# EAGLE schematic Alarm (EAGLE 8.4.1)
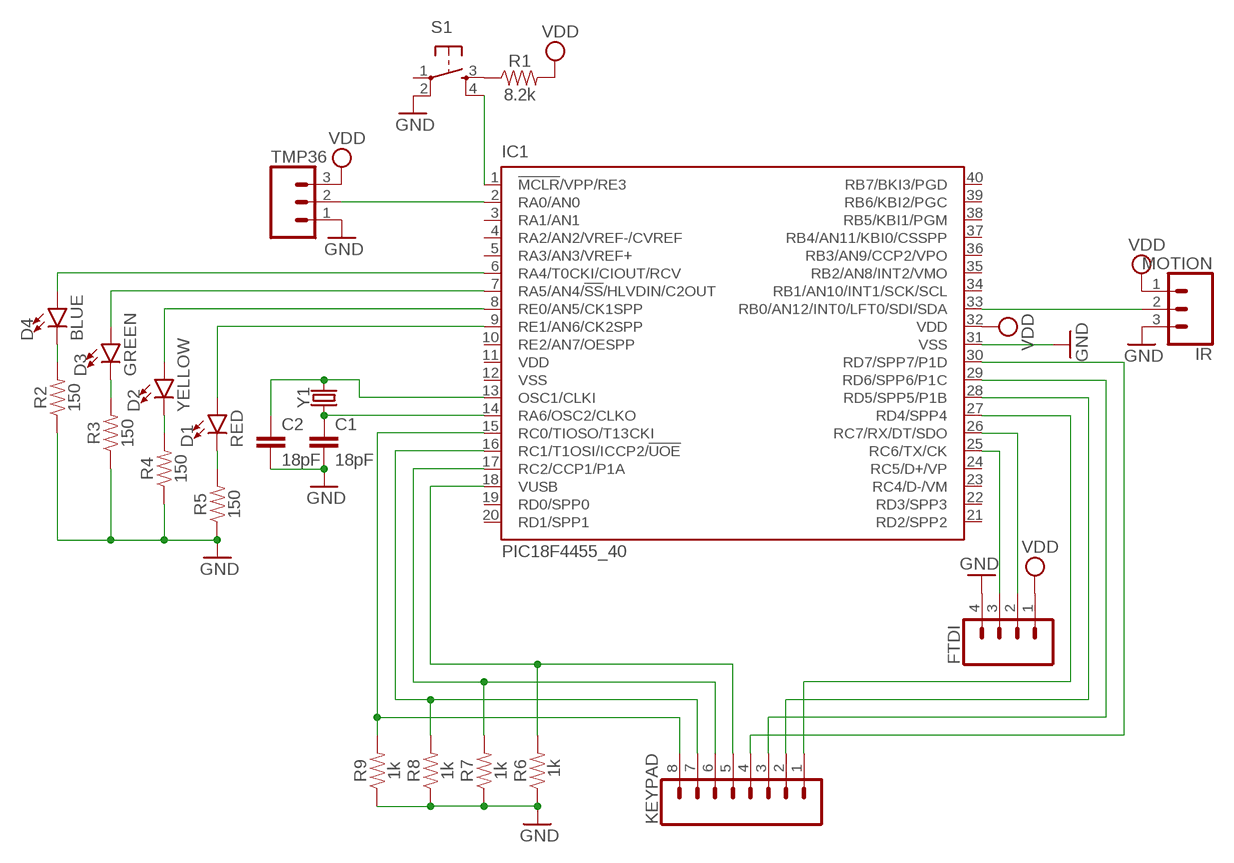
[diagram p0: schematic, sheet 1]

## Parts
C1  18pF  0.1UF-0402-16V-10%  [0402]
C2  18pF  0.1UF-0402-16V-10%  [0402]
D1  RED  LED-BLUE0603  [LED-0603]
D2  YELLOW  LED-BLUE0603  [LED-0603]
D3  GREEN  LED-BLUE0603  [LED-0603]
D4  BLUE  LED-BLUE0603  [LED-0603]
FTDI  CONN_04  [1X04]
IC1  PIC18F4455_40  [DIL40]
IR  MOTION  CONN_03  [1X03]
KEYPAD  CONN_08"  [1X08]
R1  8.2k  0.1OHM-1210-1/2W-1%  [1210]
R2  150  0.1OHM-1210-1/2W-1%  [1210]
R3  150  0.1OHM-1210-1/2W-1%  [1210]
R4  150  0.1OHM-1210-1/2W-1%  [1210]
R5  150  0.1OHM-1210-1/2W-1%  [1210]
R6  1k  0.1OHM-1210-1/2W-1%  [1210]
R7  1k  0.1OHM-1210-1/2W-1%  [1210]
R8  1k  0.1OHM-1210-1/2W-1%  [1210]
R9  1k  0.1OHM-1210-1/2W-1%  [1210]
S1  TAC_SWITCHPTH  [TACTILE-PTH]
TMP36  CONN_03  [1X03]
Y1  CRYSTALPTH-HC49US  [HC49US]

## Nets
GND: C1.2 C2.2 FTDI.4 IC1.31(VSS) IR.3 R2.1 R3.1 R4.1 R5.1 R6.1 R7.1 R8.1 R9.1 S1.2 TMP36.1
N$1: C1.1 IC1.14(RA6/OSC2/CLKO) Y1.1
N$2: C2.1 IC1.13(OSC1/CLKI) Y1.2
N$3: IC1.33(RB0/AN12/INT0/LFT0/SDI/SDA) IR.2
N$4: FTDI.2 IC1.26(RC7/RX/DT/SDO)
N$5: FTDI.3 IC1.25(RC6/TX/CK)
N$6: IC1.2(RA0/AN0) TMP36.2
N$7: IC1.1(!MCLR!/VPP/RE3) S1.4
N$8: R1.1 S1.3
N$9: D4.A IC1.6(RA4/T0CKI/CIOUT/RCV)
N$10: D3.A IC1.7(RA5/AN4/!SS!/HLVDIN/C2OUT)
N$11: D2.A IC1.8(RE0/AN5/CK1SPP)
N$12: D1.A IC1.9(RE1/AN6/CK2SPP)
N$13: D4.C R2.2
N$14: D3.C R3.2
N$15: D2.C R4.2
N$16: D1.C R5.2
N$17: IC1.27(RD4/SPP4) KEYPAD.1
N$18: IC1.28(RD5/SPP5/P1B) KEYPAD.2
N$19: IC1.29(RD6/SPP6/P1C) KEYPAD.3
N$20: IC1.30(RD7/SPP7/P1D) KEYPAD.4
N$21: IC1.15(RC0/TIOSO/T13CKI) KEYPAD.8 R9.2
N$23: IC1.17(RC2/CCP1/P1A) KEYPAD.6 R7.2
N$26: IC1.16(RC1/T1OSI/ICCP2/!UOE) KEYPAD.7 R8.2
N$27: IC1.18(VUSB) KEYPAD.5 R6.2
VDD: FTDI.1 IC1.32(VDD) IR.1 R1.2 TMP36.3
Unconnected: IC1.3(RA1/AN1) IC1.4(RA2/AN2/VREF-/CVREF) IC1.5(RA3/AN3/VREF+) IC1.10(RE2/AN7/OESPP) IC1.19(RD0/SPP0) IC1.20(RD1/SPP1) IC1.21(RD2/SPP2) IC1.22(RD3/SPP3) IC1.23(RC4/D-/VM) IC1.24(RC5/D+/VP) IC1.34(RB1/AN10/INT1/SCK/SCL) IC1.35(RB2/AN8/INT2/VMO) IC1.36(RB3/AN9/CCP2/VPO) IC1.37(RB4/AN11/KBI0/CSSPP) IC1.38(RB5/KBI1/PGM) IC1.39(RB6/KBI2/PGC) IC1.40(RB7/BKI3/PGD) S1.1

## Power pins joined to a net without a drawn wire
VDD: IC1.11(VDD)
VSS: IC1.12(VSS)

## Library data of the parts
C1 C2 = SparkFun-Capacitors:0.1UF: 0.1µF ceramic capacitors A capacitor is a passive two-terminal electrical component used to store electrical energy temporarily in an electric field.; PROD_ID: CAP-12416; VALUE: 0.1uF
D1-D3 = SparkFun-LED:LED-BLUE: Blue SMD LED Used in manufacturing of various products at SparkFun Packages: 0603 - SMD 0603 package [Product Link] <http://www.digikey.com/product-detail/en/SMLE12BC7TT86/511-1589-2-ND/1641808> 1206 - SMD1206 package [Product Link] <http://www.digikey.com/product-detail/en/lite-on-inc/LTST-C150TBKT/160-1643-1-ND/573584> SparkFun Products: ESP8266 Thing-Dev Board <https://www.sparkfun.com/products/13711> RedBoard <https://www.sparkfun.com/products/12757>; PROD_ID: DIO-08575; VALUE: BLUE
D4 = SparkFun-LED:LED-BLUE: Blue SMD LED Used in manufacturing of various products at SparkFun Packages: 0603 - SMD 0603 package [Product Link] <http://www.digikey.com/product-detail/en/SMLE12BC7TT86/511-1589-2-ND/1641808> 1206 - SMD1206 package [Product Link] <http://www.digikey.com/product-detail/en/lite-on-inc/LTST-C150TBKT/160-1643-1-ND/573584> SparkFun Products: ESP8266 Thing-Dev Board <https://www.sparkfun.com/products/13711> RedBoard <https://www.sparkfun.com/products/12757>; PROD_ID: DIO-08575
FTDI = SparkFun-Connectors:CONN_04: Multi connection point. Often used as Generic Header-pin footprint for 0.1 inch spaced/style header connections On any of the 0.1 inch spaced packages, you can populate with these: Break Away Headers - Straight <https://www.sparkfun.com/products/116> (PRT-00116) Break Away Male Headers - Right Angle <https://www.sparkfun.com/products/553> (PRT-00553) Female Headers <https://www.sparkfun.com/products/115> (PRT-00115) Break Away Headers - Machine Pin <https://www.sparkfun.com/products/117> (PRT-00117) Break Away Female Headers - Swiss Machine Pin <https://www.sparkfun.com/products/743> (PRT-00743) For SCREWTERMINALS and SPRING TERMINALS visit here: Screw Terimnals on SparkFun.com <https://www.sparkfun.com/search/results?term=Screw+Terminals> (5mm/3.5mm/2.54mm spacing) This device is also useful as a general connection point to wire up your design to another part of your project. Our various solder wires solder well into these plated through hole pads. Hook-Up Wire - Assortment (Stranded, 22 AWG) <https://www.sparkfun.com/products/11375> (PRT-11375) Hook-Up Wire - Assortment (Solid Core, 22 AWG) <https://www.sparkfun.com/products/11367> (PRT-11367) View the entire wire category on our website here <https://www.sparkfun.com/categories/141> Special notes: Molex polarized connector foot print use with SKU : PRT-08231 with associated crimp pins and housings. 1MM SMD Version SKU: PRT-10208; PROD_ID: CONN-09696
IC1 = microchip:PIC18F4*_40: USB Microcontrollers with nanoWatt Technology High-Performance, Enhanced Flash, 28/40/44-Pin, Source: http://ww1.microchip.com/downloads/en/devicedoc/39632c.pdf; MF: MICROCHIP; MPN: PIC18F4455-I/P; OC_FARNELL: 9321314; OC_NEWARK: 05K2028
IR TMP36 = SparkFun-Connectors:CONN_03: Multi connection point. Often used as Generic Header-pin footprint for 0.1 inch spaced/style header connections On any of the 0.1 inch spaced packages, you can populate with these: Break Away Headers - Straight <https://www.sparkfun.com/products/116> (PRT-00116) Break Away Male Headers - Right Angle <https://www.sparkfun.com/products/553> (PRT-00553) Female Headers <https://www.sparkfun.com/products/115> (PRT-00115) Break Away Headers - Machine Pin <https://www.sparkfun.com/products/117> (PRT-00117) Break Away Female Headers - Swiss Machine Pin <https://www.sparkfun.com/products/743> (PRT-00743) Stackable Header - 3 Pin (Female, 0.1") <https://www.sparkfun.com/products/13875> (PRT-13875) For SCREWTERMINALS and SPRING TERMINALS visit here: Screw Terimnals on SparkFun.com <https://www.sparkfun.com/search/results?term=Screw+Terminals> (5mm/3.5mm/2.54mm spacing) This device is also useful as a general connection point to wire up your design to another part of your project. Our various solder wires solder well into these plated through hole pads. Hook-Up Wire - Assortment (Stranded, 22 AWG) <https://www.sparkfun.com/products/11375> (PRT-11375) Hook-Up Wire - Assortment (Solid Core, 22 AWG) <https://www.sparkfun.com/products/11367> (PRT-11367) View the entire wire category on our website here <https://www.sparkfun.com/categories/141> Special notes: Molex polarized connector foot print use with SKU : PRT-08232 with associated crimp pins and housings.; PROD_ID: XXX-00000; VALUE: 455-1750-1-ND
KEYPAD = SparkFun-Connectors:CONN_08: Multi connection point. Often used as Generic Header-pin footprint for 0.1 inch spaced/style header connections On any of the 0.1 inch spaced packages, you can populate with these: Break Away Headers - Straight <https://www.sparkfun.com/products/116> (PRT-00116) Break Away Male Headers - Right Angle <https://www.sparkfun.com/products/553> (PRT-00553) Female Headers <https://www.sparkfun.com/products/115> (PRT-00115) Break Away Headers - Machine Pin <https://www.sparkfun.com/products/117> (PRT-00117) Break Away Female Headers - Swiss Machine Pin <https://www.sparkfun.com/products/743> (PRT-00743) Arduino Stackable Header - 8 Pin <https://www.sparkfun.com/products/9279> (PRT-09279) For SCREWTERMINALS and SPRING TERMINALS visit here: Screw Terimnals on SparkFun.com <https://www.sparkfun.com/search/results?term=Screw+Terminals> (5mm/3.5mm/2.54mm spacing) This device is also useful as a general connection point to wire up your design to another part of your project. Our various solder wires solder well into these plated through hole pads. Hook-Up Wire - Assortment (Stranded, 22 AWG) <https://www.sparkfun.com/products/11375> (PRT-11375) Hook-Up Wire - Assortment (Solid Core, 22 AWG) <https://www.sparkfun.com/products/11367> (PRT-11367) View the entire wire category on our website here <https://www.sparkfun.com/categories/141> Special notes: Molex polarized connector foot print use with SKU : PRT-08231 with associated crimp pins and housings. 1MM SMD Version SKU: PRT-10208 NOTES ON THE VARIANTS LOCK and LOCK_LONGPADS... This footprint was designed to help hold the alignment of a through-hole component (i.e. 6-pin header) while soldering it into place. You may notice that each hole has been shifted either up or down by 0.005 of an inch from it's more standard position (which is a perfectly straight line). This slight alteration caused the pins (the squares in the middle) to touch the edges of the holes. Because they are alternating, it causes a "brace" to hold the component in place. 0.005 has proven to be the perfect amount of "off-center" position when using our standard breakaway headers. Although looks a little odd when you look at the bare footprint, once you have a header in there, the alteration is very hard to notice. Also,if you push a header all the way into place, it is covered up entirely on the bottom side.; PROD_ID: CONN-08438
R1-R9 = SparkFun-Resistors:0.1OHM: 0.1Ω resistor A resistor is a passive two-terminal electrical component that implements electrical resistance as a circuit element. Resistors act to reduce current flow, and, at the same time, act to lower voltage levels within circuits. - Wikipedia; PROD_ID: RES-12374; VALUE: 0.1
S1 = SparkFun-Retired:TAC_SWITCH: Momentary Switch Button commonly used for reset or general input. Spark Fun Electronics SKU : COM-00097 SMT- SWCH-08247
Y1 = SparkFun-Clocks:CRYSTAL: Crystals (Generic) These are passive quartz crystals, which can be used as a clock source for a microcontroller. Crystal's are two-terminal devices. They require external "load" capacitors to generate an oscillating signal.